# EAGLE design reguladores (EAGLE 9.3.0)
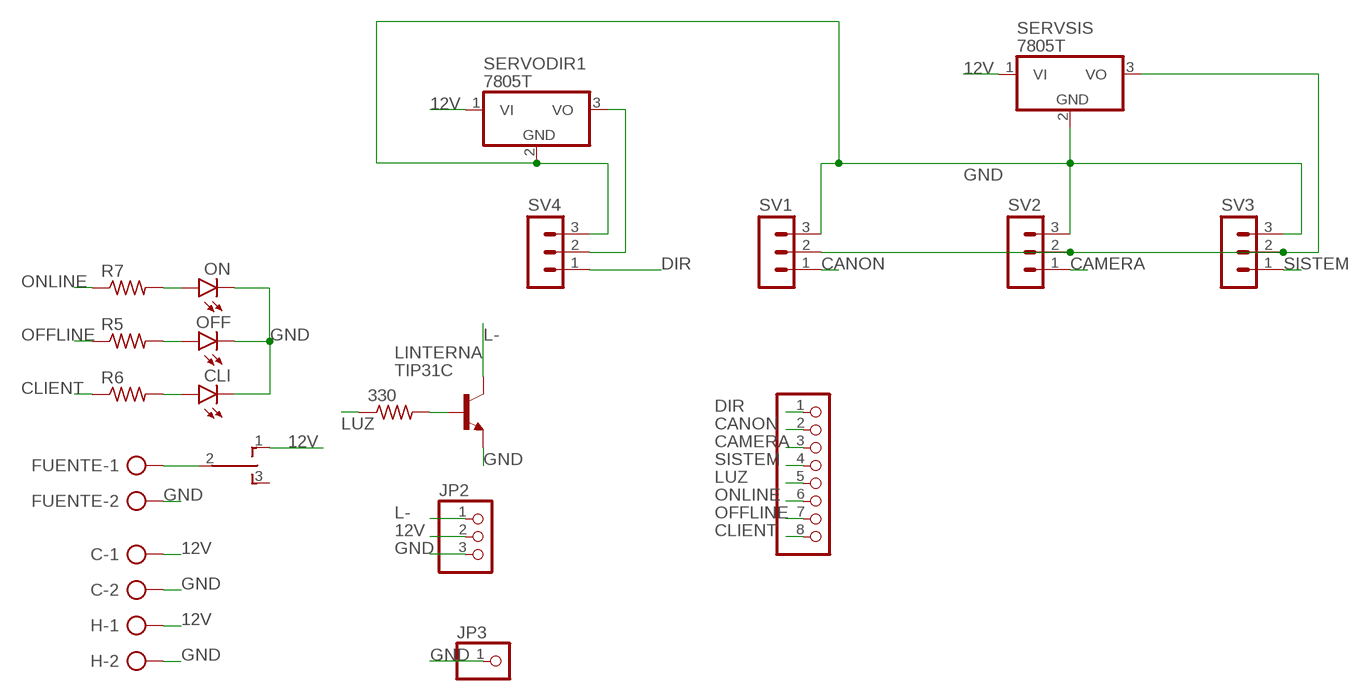
[diagram p0: schematic, sheet 1]

## Parts
330  R-US_0204/7  [0204/7]
C  AK500/2-H  [AK500/2-H]
CLI  LED5MM  [LED5MM]
FUENTE  AK500/2-H  [AK500/2-H]
H  AK500/2-H  [AK500/2-H]
JP1  PINHD-1X8  [1X08]
JP2  PINHD-1X3  [1X03]
JP3  PINHD-1X1  [1X01]
LINTERNA  TIP31C  [TO220]
OFF  LED5MM  [LED5MM]
ON  LED5MM  [LED5MM]
R5  R-US_0204/7  [0204/7]
R6  R-US_0204/7  [0204/7]
R7  R-US_0204/7  [0204/7]
S1  TL39WO  [TL3XWO]
SERVODIR1  7805T  [TO220H]
SERVSIS  7805T  [TO220H]
SV1  MA03-1  [MA03-1]
SV2  MA03-1  [MA03-1]
SV3  MA03-1  [MA03-1]
SV4  MA03-1  [MA03-1]

## Nets
12V: C.1 H.1 JP2.2 S1.1(O) SERVODIR1.1(VI) SERVSIS.1(VI)
CAMERA: JP1.3 SV2.1
CANON: JP1.2 SV1.1
CLIENT: JP1.8 R6.1
DIR: JP1.1 SV4.1
GND: C.2 CLI.K(C) FUENTE.2 H.2 JP2.3 JP3.1 LINTERNA.3(E) OFF.K(C) ON.K(C) SERVODIR1.2(GND) SERVSIS.2(GND) SV1.3 SV2.3 SV3.3 SV4.3
L-: JP2.1 LINTERNA.2(C)
LUZ: 330.1 JP1.5
N$1: SERVSIS.3(VO) SV1.2 SV2.2 SV3.2
N$2: FUENTE.1 S1.2(P)
N$4: SERVODIR1.3(VO) SV4.2
N$5: 330.2 LINTERNA.1(B)
N$6: ON.A R7.2
N$7: OFF.A R5.2
N$8: CLI.A R6.2
OFFLINE: JP1.7 R5.1
ONLINE: JP1.6 R7.1
SISTEM: JP1.4 SV3.1
Unconnected: S1.3(S)

## Library data of the parts
330 R5-R7 = rcl:R-US_: RESISTOR, American symbol; SPICEPREFIX: R
C FUENTE H = con-ptr500:AK500/2-H: CONNECTOR Aug. 2004 / PTR Meßtechnik: Die Bezeichnung der Serie AK505 wurde geändert. Es handelt sich hierbei um AK500 in horizontaler Ausführung.; OC_FARNELL: unknown; OC_NEWARK: unknown
CLI OFF ON = led:LED: LED OSRAM: - CHIPLED LG R971, LG N971, LY N971, LG Q971, LY Q971, LO R971, LY R971 LH N974, LH R974 LS Q976, LO Q976, LY Q976 LO Q996 - Hyper CHIPLED LW Q18S LB Q993, LB Q99A, LB R99A - SideLED LS A670, LO A670, LY A670, LG A670, LP A670 LB A673, LV A673, LT A673, LW A673 LH A674 LY A675 LS A676, LA A676, LO A676, LY A676, LW A676 LS A679, LY A679, LG A679 - Hyper Micro SIDELED® LS Y876, LA Y876, LO Y876, LY Y876 LT Y87S - SmartLED LW L88C, LW L88S LB L89C, LB L89S, LG L890 LS L89K, LO L89K, LY L89K LS L896, LA L896, LO L896, LY L896 - TOPLED LS T670, LO T670, LY T670, LG T670, LP T670 LSG T670, LSP T670, LSY T670, LOP T670, LYG T670 LG T671, LOG T671, LSG T671 LB T673, LV T673, LT T673, LW T673 LH T674 LS T676, LA T676, LO T676, LY T676, LB T676, LH T676, LSB T676, LW T676 LB T67C, LV T67C, LT T67C, LS T67K, LO T67K, LY T67K, LW E67C LS E67B, LA E67B, LO E67B, LY E67B, LB E67C, LV E67C, LT E67C LW T67C LS T679, LY T679, LG T679 LS T770, LO T770, LY T770, LG T770, LP T770 LB T773, LV T773, LT T773, LW T773 LH T774 LS E675, LA E675, LY E675, LS T675 LS T776, LA T776, LO T776, LY T776, LB T776 LHGB T686 LT T68C, LB T68C - Hyper Mini TOPLED® LB M676 - Mini TOPLED Santana® LG M470 LS M47K, LO M47K, LY M47K Source: http://www.osram.convergy.de LUXEON: - LUMILED® LXK2-PW12-R00, LXK2-PW12-S00, LXK2-PW14-U00, LXK2-PW14-V00 LXK2-PM12-R00, LXK2-PM12-S00, LXK2-PM14-U00 LXK2-PE12-Q00, LXK2-PE12-R00, LXK2-PE12-S00, LXK2-PE14-T00, LXK2-PE14-U00 LXK2-PB12-K00, LXK2-PB12-L00, LXK2-PB12-M00, LXK2-PB14-N00, LXK2-PB14-P00, LXK2-PB14-Q00 LXK2-PR12-L00, LXK2-PR12-M00, LXK2-PR14-Q00, LXK2-PR14-R00 LXK2-PD12-Q00, LXK2-PD12-R00, LXK2-PD12-S00 LXK2-PH12-R00, LXK2-PH12-S00 LXK2-PL12-P00, LXK2-PL12-Q00, LXK2-PL12-R00 Source: www.luxeon.com KINGBRIGHT: KA-3528ASYC Source: www.kingbright.com
JP1 = pinhead:PINHD-1X8: PIN HEADER
JP2 = pinhead:PINHD-1X3: PIN HEADER
JP3 = pinhead:PINHD-1X1: PIN HEADER
LINTERNA = transistor:TIP31: NPN Transistor Medium Power Linear Switching Applications Source: http://onsemi.com
S1 = switch:TL39WO: TINY SWITCH ON OFF ON Source: http://www2.produktinfo.conrad.com/datenblaetter/700000-724999/705152-da-01-de-Subminiaturschalter_TL_36WO.pdf
SERVODIR1 SERVSIS = linear:78*: Positive VOLTAGE REGULATOR Source: http://cache.national.com/ds/LM/LM78L05.pdf http://www.fairchildsemi.com/ds/LM/LM7805.pdf
SV1-SV4 = con-lstb:MA03-1: PIN HEADER; OC_FARNELL: unknown; OC_NEWARK: unknown

## Board
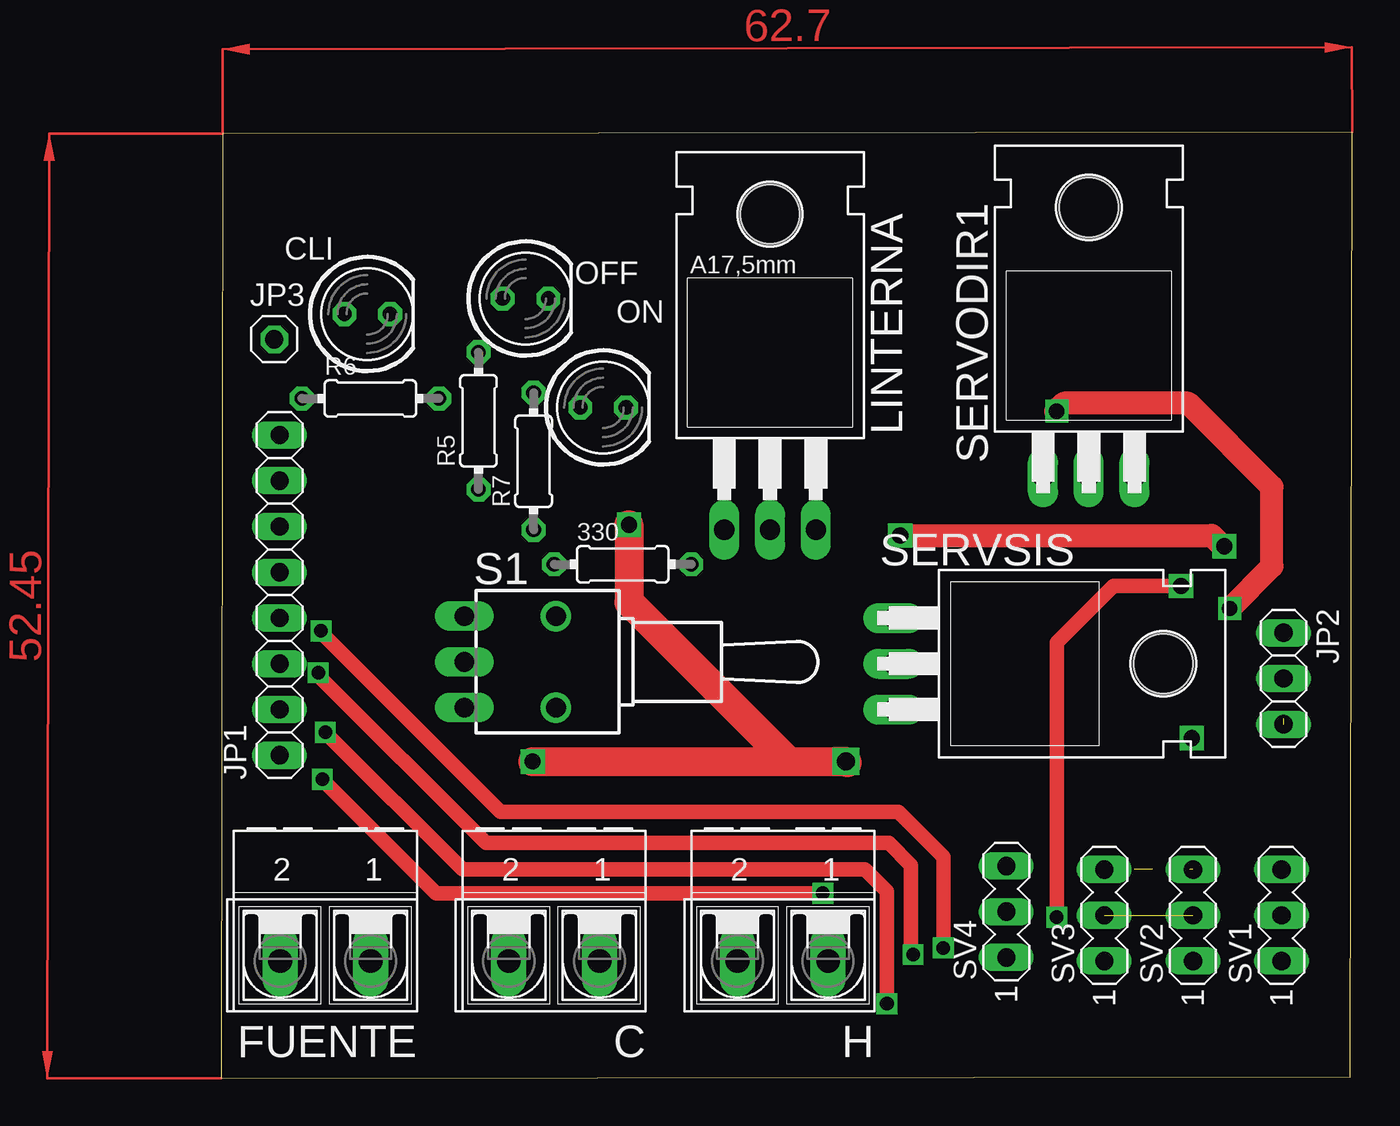
[diagram p1: board, top side]
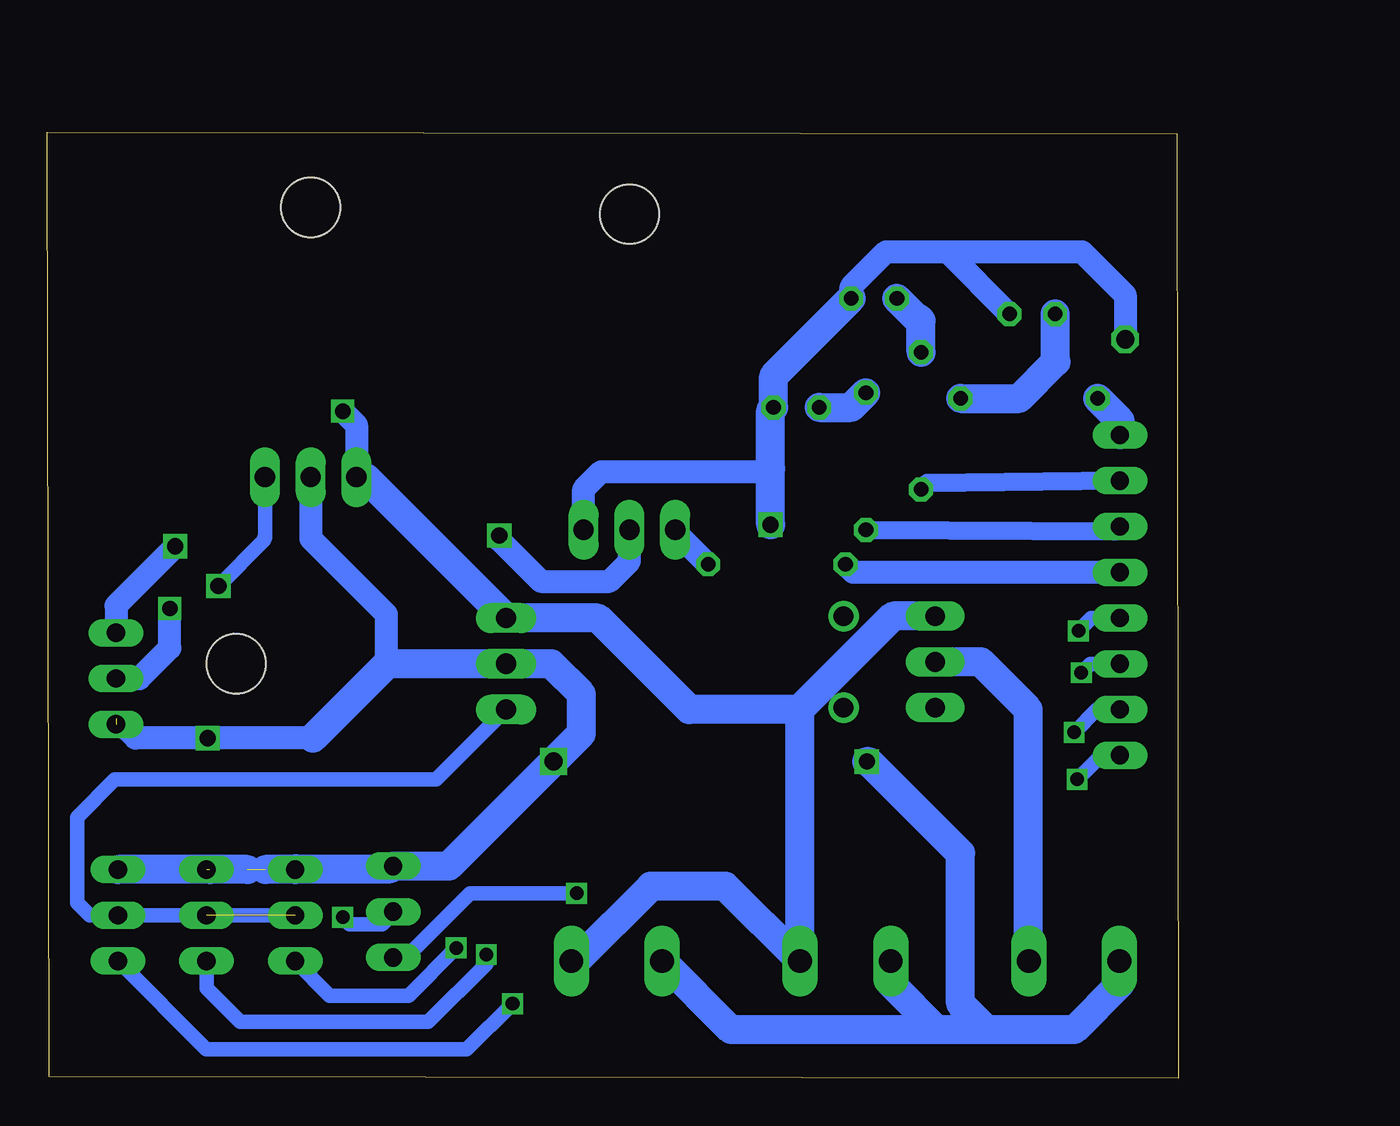
[diagram p2: board, bottom side, seen from below]

Size 62.8 x 52.55 mm. Coordinates in mm from the lower left corner, seen from the top.
Outline: 0,0 62.7,0.1 62.8,52.55 0.1,52.45 0,0
Copper layers (1*16): Top 0.035mm / dielectric 1.5mm / Bottom 0.035mm
Design rules "default": minimum track width 6mil, minimum drill 0.35mm, track to track 6mil, track to pad 6mil, pad to pad 6mil, via to via 6mil, smd to smd 6mil, copper to edge 40mil, drill to drill 6mil, minimum pad ring 10mil, minimum via ring 8mil, stop-mask expansion 4mil, vias tented up to drill 0mil, thermal gap 10mil

### Footprints (pad centres in the part's own frame; a part is rotated, then mirrored left to right if it is on the bottom)
0204/7 = drill 0.813 octagon: 1 -3.81,0; 2 3.81,0
AK500/2-H = drill 1.321 long: 1 -2.515,0; 2 2.515,0
LED5MM = drill 0.813 octagon: A -1.27,0; K 1.27,0
1X08 = drill 1.016 long: 1 -8.89,0; 2 -6.35,0; 3 -3.81,0; 4 -1.27,0; 5 1.27,0; 6 3.81,0; 7 6.35,0; 8 8.89,0
1X03 = drill 1.016 long: 1 -2.54,0; 2 0,0; 3 2.54,0
1X01 = drill 1.016 octagon: 1 0,0
TO220 = drill 1.118 long: 1 -2.54,-6.35; 2 0,-6.35; 3 2.54,-6.35 | hole 3.302: 0,11.176
TL3XWO = drill 1.1 pad 1.422 long: 1 -2.54,-5.08; 2 0,-5.08; 3 2.54,-5.08 | drill 1.1 pad 1.676: M1 -2.54,0; M2 2.54,0
TO220H = drill 1.118 long: 1 -2.54,-10.16; 2 0,-10.16; 3 2.54,-10.16 | hole 3.302: 0,4.826
MA03-1 = drill 1.016 long: 1 -2.54,0; 2 0,0; 3 2.54,0

### Placement (x,y rotation side)
330  22.3,28.55 0 top
C  18.49,6.52 180 top
CLI  8.11,42.45 0 top
FUENTE  5.79,6.52 180 top
H  31.19,6.52 180 top
JP1  3.25,26.84 90 top
JP2  58.99,22.21 270 top
JP3  2.95,41.05 0 top
LINTERNA  30.48,36.82 0 top
OFF  16.9,43.31 0 top
ON  21.21,37.26 0 top
R5  14.29,36.52 90 top
R6  8.29,37.76 0 top
R7  17.35,34.27 90 top
S1  18.59,23.13 270 top
SERVODIR1  48.18,43.55 0 top
SERVSIS  47.49,23.03 270 top
SV1  58.88,9.06 90 top
SV2  53.96,9.06 90 top
SV3  49.04,9.06 90 top
SV4  43.6,9.26 90 top

### Tracks (layer width: path | path; a pad name or v marks a point on that pad's centre or on a via)
12V  (via drill 0.85)
  Top 1.27: v56,26.1 58.35,28.45 58.35,32.85 53.7,37.5 46.8,37.5 46.35,37.05 v46.4,37.05
  Bottom 1.27: JP2.2 57.69,22.21 56,23.9 v56,26.1 | v46.4,37.05 45.64,36.29 SERVODIR1.1
  Bottom 1.6: H.1 33.45,6.52 29.3,10.68 25.16,10.68 C.1 21.03,6.54 21.03,20.49 | S1.1 15.85,25.67 21.03,20.49 | 21.03,20.49 27.15,20.49 32.23,25.57 SERVSIS.1 45.15,33.39 SERVODIR1.1
CAMERA  (via drill 0.75)
  Top 0.813: v5.39,22.53 5.39,22.38 14.7,13.07 37.07,13.07 38.3,11.84 38.3,7 v38.43,6.88
  Bottom 0.813: v5.39,22.53 4.89,23.03 JP1.3 | v38.43,6.88 38.43,6.37 41.65,3.15 52.1,3.15 53.96,5.01 SV2.1
CANON  (via drill 0.75)
  Top 0.813: v5.79,19.22 13.41,11.6 35.75,11.6 36.97,10.38 v36.97,4.15
  Bottom 0.813: JP1.2 4.52,20.49 v5.79,19.22 | v36.97,4.15 39.51,1.61 53.97,1.61 SV1.1
CLIENT
  Bottom 1.016: JP1.8 3.35,35.83
  Bottom 1.6: JP1.8 3.25,36.53 R6.1
DIR  (via drill 0.75)
  Top 0.813: v5.62,16.61 11.95,10.28 v33.41,10.28
  Bottom 0.813: v5.62,16.61 4.28,17.95 JP1.1 | v33.41,10.28 39.32,10.28 42.88,6.72 SV4.1
GND  (via drill 0.9, 1)  (3 unrouted)
  Top 1.6: v22.65,30.75 22.65,26.45 31.5,17.6 | v17.3,17.6 31.5,17.6 | 34.77,17.52 v34.7,17.6 31.5,17.6
  Bottom 0.813: 58.99,19.99 58.67,19.67
  Bottom 1.27: 53.8,11.6 53.75,11.6 | SERVODIR1.2 48.18,29.98 43.98,25.78 43.98,23.03 | 48.05,18.9 v53.9,18.9 57.9,18.9 58.67,19.67 | OFF.K 18.17,43.96 16.23,45.9 12.83,45.9 | 12.83,45.9 CLI.K | LINTERNA.3 33.02,32.73 32.05,33.7 22.8,33.7 22.65,33.85 | 12.83,45.9 5.35,45.9 2.95,43.5 JP3.1
  Bottom 1.6: FUENTE.2 3.27,5.22 5.79,2.71 10.65,2.71 | 10.65,2.71 13.41,2.71 | 13.41,2.71 15.97,5.28 C.2 | 13.41,2.71 24.84,2.71 28.65,6.52 H.2 | 50.7,11.6 SV3.3 48.99,11.65 43.75,11.65 SV4.3 40.5,11.8 v34.7,17.6 33.15,19.15 33.15,21.35 34.83,23.03 SERVSIS.2 43.98,23.03 43.95,23 48.05,18.9 | 51.7,11.6 53.75,11.6 SV1.3 | 10.65,2.71 12.1,4.16 12.1,12.5 17.2,17.6 v17.3,17.6 | v22.65,30.75 22.65,33.85 22.65,37.09 ON.K 22.48,39 OFF.K
L-  (via drill 0.9)
  Top 0.813: 55.65,29.5 v55.7,29.55
  Top 1.27: v37.7,30.15 55,30.15 55.65,29.5
  Bottom 1.27: v37.7,30.15 37.7,29.9 35.4,27.6 31.6,27.6 30.48,28.72 LINTERNA.2 | JP2.1 58.99,26.26 v55.7,29.55
LUZ
  Bottom 1.27: JP1.5 18.05,28.11 330.1
N$1  (1 unrouted)
  Bottom 0.813: SV3.2 SV1.2 60.46,9.06 61.15,9.75 61.15,14.5 59.05,16.6 41.22,16.6 SERVSIS.3
N$2
  Bottom 1.6: FUENTE.1 8.33,6.54 8.33,20.49 10.97,23.13 S1.2
N$4  (via drill 0.75, 0.9)
  Top 0.813: v46.4,8.95 46.4,24.2 49.55,27.35 v53.3,27.35
  Bottom 0.813: SV4.2 43.6,9.16 44.2,8.56 46.01,8.56 v46.4,8.95 | v53.3,27.35 50.75,29.9 50.75,30.01 50.72,30.04 SERVODIR1.3
N$5
  Bottom 1.27: 330.2 27.94,30.38 LINTERNA.1
N$6
  Bottom 1.6: ON.A 18.17,37.26 R7.2
N$7
  Bottom 1.6: R5.2 14.29,42.08 14.43,42.22 14.54,42.22 OFF.A
N$8
  Bottom 1.6: R6.2 8.84,37.76 6.8,39.8 6.84,39.84 CLI.A
OFFLINE
  Bottom 1.016: R5.1 13.94,33.06 JP1.7
ONLINE
  Bottom 1.016: R7.1 3.54,30.36 JP1.6
SISTEM  (via drill 0.75)
  Top 0.813: v40.1,7.25 40.1,12.3 37.6,14.8 15.52,14.8 5.55,24.77 v5.55,24.85
  Bottom 0.813: SV3.1 47.12,4.6 42.75,4.6 v40.1,7.25 | v5.55,24.85 4.83,25.57 JP1.4
(copper drawn outside any net)
  shapes: Top area x2